# Altium schematic sheet Lights.SchDoc: RGB LEDS
size Letter; Author: Parth Thakkar; CompanyName: Insane Corp; DrawnBy: Parth Thakkar; Engineer: Parth Thakkar; Organization: Low Self Esteem; Revision: v1.0; SheetNumber: 8; SheetTotal: 8
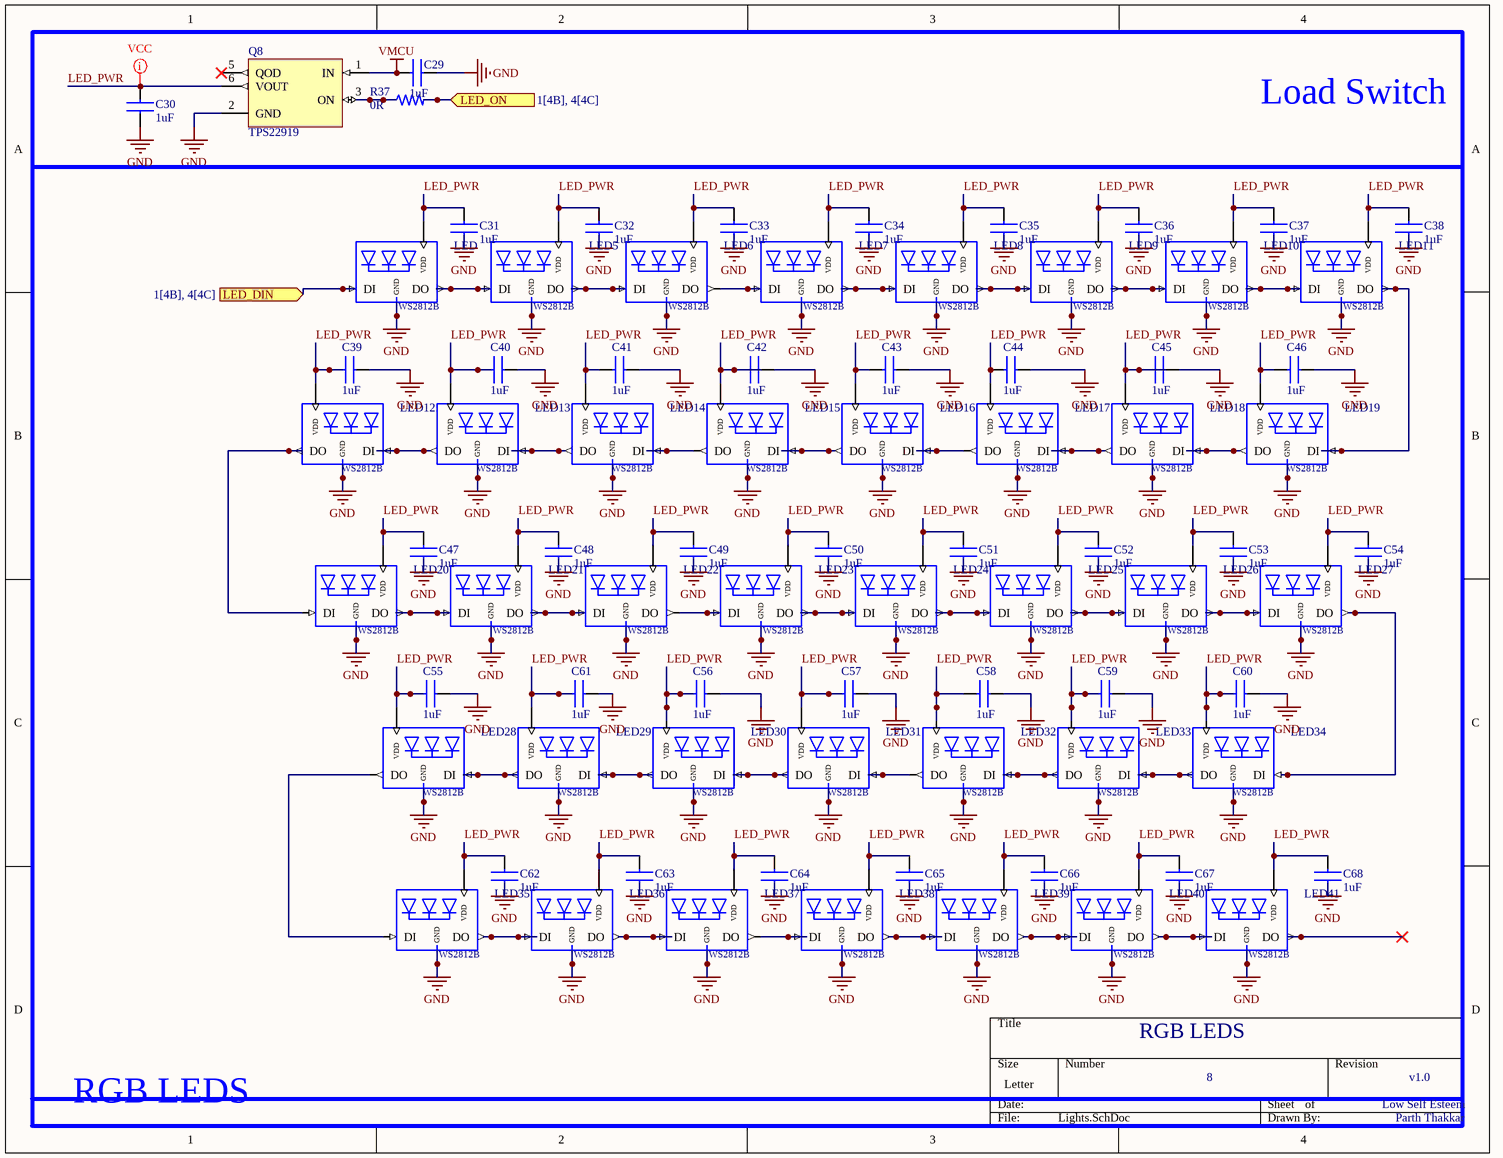
[diagram p0: Lights.SchDoc]

## Parts
C29  value 1uF  [Capacitor 0603]  (hidden comment: CAP 1uF 10V 0603)
C30  value 1uF  [CAPACITOR 0805]  (hidden comment: CAP 47uF 10V 0805)
C31  value 1uF  [Capacitor 0603]  (hidden comment: CAP 1uF 10V 0603)
C32  value 1uF  [Capacitor 0603]  (hidden comment: CAP 1uF 10V 0603)
C33  value 1uF  [Capacitor 0603]  (hidden comment: CAP 1uF 10V 0603)
C34  value 1uF  [Capacitor 0603]  (hidden comment: CAP 1uF 10V 0603)
C35  value 1uF  [Capacitor 0603]  (hidden comment: CAP 1uF 10V 0603)
C36  value 1uF  [Capacitor 0603]  (hidden comment: CAP 1uF 10V 0603)
C37  value 1uF  [Capacitor 0603]  (hidden comment: CAP 1uF 10V 0603)
C38  value 1uF  [Capacitor 0603]  (hidden comment: CAP 1uF 10V 0603)
C39  value 1uF  [Capacitor 0603]  (hidden comment: CAP 1uF 10V 0603)
C40  value 1uF  [Capacitor 0603]  (hidden comment: CAP 1uF 10V 0603)
C41  value 1uF  [Capacitor 0603]  (hidden comment: CAP 1uF 10V 0603)
C42  value 1uF  [Capacitor 0603]  (hidden comment: CAP 1uF 10V 0603)
C43  value 1uF  [Capacitor 0603]  (hidden comment: CAP 1uF 10V 0603)
C44  value 1uF  [Capacitor 0603]  (hidden comment: CAP 1uF 10V 0603)
C45  value 1uF  [Capacitor 0603]  (hidden comment: CAP 1uF 10V 0603)
C46  value 1uF  [Capacitor 0603]  (hidden comment: CAP 1uF 10V 0603)
C47  value 1uF  [Capacitor 0603]  (hidden comment: CAP 1uF 10V 0603)
C48  value 1uF  [Capacitor 0603]  (hidden comment: CAP 1uF 10V 0603)
C49  value 1uF  [Capacitor 0603]  (hidden comment: CAP 1uF 10V 0603)
C50  value 1uF  [Capacitor 0603]  (hidden comment: CAP 1uF 10V 0603)
C51  value 1uF  [Capacitor 0603]  (hidden comment: CAP 1uF 10V 0603)
C52  value 1uF  [Capacitor 0603]  (hidden comment: CAP 1uF 10V 0603)
C53  value 1uF  [Capacitor 0603]  (hidden comment: CAP 1uF 10V 0603)
C54  value 1uF  [Capacitor 0603]  (hidden comment: CAP 1uF 10V 0603)
C55  value 1uF  [Capacitor 0603]  (hidden comment: CAP 1uF 10V 0603)
C56  value 1uF  [Capacitor 0603]  (hidden comment: CAP 1uF 10V 0603)
C57  value 1uF  [Capacitor 0603]  (hidden comment: CAP 1uF 10V 0603)
C58  value 1uF  [Capacitor 0603]  (hidden comment: CAP 1uF 10V 0603)
C59  value 1uF  [Capacitor 0603]  (hidden comment: CAP 1uF 10V 0603)
C60  value 1uF  [Capacitor 0603]  (hidden comment: CAP 1uF 10V 0603)
C61  value 1uF  [Capacitor 0603]  (hidden comment: CAP 1uF 10V 0603)
C62  value 1uF  [Capacitor 0603]  (hidden comment: CAP 1uF 10V 0603)
C63  value 1uF  [Capacitor 0603]  (hidden comment: CAP 1uF 10V 0603)
C64  value 1uF  [Capacitor 0603]  (hidden comment: CAP 1uF 10V 0603)
C65  value 1uF  [Capacitor 0603]  (hidden comment: CAP 1uF 10V 0603)
C66  value 1uF  [Capacitor 0603]  (hidden comment: CAP 1uF 10V 0603)
C67  value 1uF  [Capacitor 0603]  (hidden comment: CAP 1uF 10V 0603)
C68  value 1uF  [Capacitor 0603]  (hidden comment: CAP 1uF 10V 0603)
LED  WS2812B  [WS2812B]  (value not drawn)
LED5  WS2812B  [WS2812B]  (value not drawn)
LED6  WS2812B  [WS2812B]  (value not drawn)
LED7  WS2812B  [WS2812B]  (value not drawn)
LED8  WS2812B  [WS2812B]  (value not drawn)
LED9  WS2812B  [WS2812B]  (value not drawn)
LED10  WS2812B  [WS2812B]  (value not drawn)
LED11  WS2812B  [WS2812B]  (value not drawn)
LED12  WS2812B  [WS2812B]  (value not drawn)
LED13  WS2812B  [WS2812B]  (value not drawn)
LED14  WS2812B  [WS2812B]  (value not drawn)
LED15  WS2812B  [WS2812B]  (value not drawn)
LED16  WS2812B  [WS2812B]  (value not drawn)
LED17  WS2812B  [WS2812B]  (value not drawn)
LED18  WS2812B  [WS2812B]  (value not drawn)
LED19  WS2812B  [WS2812B]  (value not drawn)
LED20  WS2812B  [WS2812B]  (value not drawn)
LED21  WS2812B  [WS2812B]  (value not drawn)
LED22  WS2812B  [WS2812B]  (value not drawn)
LED23  WS2812B  [WS2812B]  (value not drawn)
LED24  WS2812B  [WS2812B]  (value not drawn)
LED25  WS2812B  [WS2812B]  (value not drawn)
LED26  WS2812B  [WS2812B]  (value not drawn)
LED27  WS2812B  [WS2812B]  (value not drawn)
LED28  WS2812B  [WS2812B]  (value not drawn)
LED29  WS2812B  [WS2812B]  (value not drawn)
LED30  WS2812B  [WS2812B]  (value not drawn)
LED31  WS2812B  [WS2812B]  (value not drawn)
LED32  WS2812B  [WS2812B]  (value not drawn)
LED33  WS2812B  [WS2812B]  (value not drawn)
LED34  WS2812B  [WS2812B]  (value not drawn)
LED35  WS2812B  [WS2812B]  (value not drawn)
LED36  WS2812B  [WS2812B]  (value not drawn)
LED37  WS2812B  [WS2812B]  (value not drawn)
LED38  WS2812B  [WS2812B]  (value not drawn)
LED39  WS2812B  [WS2812B]  (value not drawn)
LED40  WS2812B  [WS2812B]  (value not drawn)
LED41  WS2812B  [WS2812B]  (value not drawn)
Q8  TPS22919  [TPS22919DCKR - Load SW]
R37  value 0R  [Resistor 0402]  (hidden comment: RES 0R 0402)

## Ports
LED_DIN (in, see 1[4B], 4[4C]), LED_ON (in, see 1[4B], 4[4C])

## Nets
GND: C29.2 C30.2 C31.2 C32.2 C33.2 C34.2 C35.2 C36.2 C37.2 C38.2 C39.2 C40.2 C41.2 C42.2 C43.2 C44.2 C45.2 C46.2 C47.2 C48.2 C49.2 C50.2 C51.2 C52.2 C53.2 C54.2 C55.2 C56.2 C57.2 C58.2 C59.2 C60.2 C61.2 C62.2 C63.2 C64.2 C65.2 C66.2 C67.2 C68.2 LED.3-GND(GND) LED5.3-GND(GND) LED6.3-GND(GND) LED7.3-GND(GND) LED8.3-GND(GND) LED9.3-GND(GND) LED10.3-GND(GND) LED11.3-GND(GND) LED12.3-GND(GND) LED13.3-GND(GND) LED14.3-GND(GND) LED15.3-GND(GND) LED16.3-GND(GND) LED17.3-GND(GND) LED18.3-GND(GND) LED19.3-GND(GND) LED20.3-GND(GND) LED21.3-GND(GND) LED22.3-GND(GND) LED23.3-GND(GND) LED24.3-GND(GND) LED25.3-GND(GND) LED26.3-GND(GND) LED27.3-GND(GND) LED28.3-GND(GND) LED29.3-GND(GND) LED30.3-GND(GND) LED31.3-GND(GND) LED32.3-GND(GND) LED33.3-GND(GND) LED34.3-GND(GND) LED35.3-GND(GND) LED36.3-GND(GND) LED37.3-GND(GND) LED38.3-GND(GND) LED39.3-GND(GND) LED40.3-GND(GND) LED41.3-GND(GND) Q8.2(GND)
VMCU: C29.1 Q8.1(IN)
LED_DIN: LED.4-DIN(DI) ; port LED_DIN
LED_ON: R37.2 ; port LED_ON
LED_PWR: C30.1 C31.1 C32.1 C33.1 C34.1 C35.1 C36.1 C37.1 C38.1 C39.1 C40.1 C41.1 C42.1 C43.1 C44.1 C45.1 C46.1 C47.1 C48.1 C49.1 C50.1 C51.1 C52.1 C53.1 C54.1 C55.1 C56.1 C57.1 C58.1 C59.1 C60.1 C61.1 C62.1 C63.1 C64.1 C65.1 C66.1 C67.1 C68.1 LED.1-VDD(VDD) LED5.1-VDD(VDD) LED6.1-VDD(VDD) LED7.1-VDD(VDD) LED8.1-VDD(VDD) LED9.1-VDD(VDD) LED10.1-VDD(VDD) LED11.1-VDD(VDD) LED12.1-VDD(VDD) LED13.1-VDD(VDD) LED14.1-VDD(VDD) LED15.1-VDD(VDD) LED16.1-VDD(VDD) LED17.1-VDD(VDD) LED18.1-VDD(VDD) LED19.1-VDD(VDD) LED20.1-VDD(VDD) LED21.1-VDD(VDD) LED22.1-VDD(VDD) LED23.1-VDD(VDD) LED24.1-VDD(VDD) LED25.1-VDD(VDD) LED26.1-VDD(VDD) LED27.1-VDD(VDD) LED28.1-VDD(VDD) LED29.1-VDD(VDD) LED30.1-VDD(VDD) LED31.1-VDD(VDD) LED32.1-VDD(VDD) LED33.1-VDD(VDD) LED34.1-VDD(VDD) LED35.1-VDD(VDD) LED36.1-VDD(VDD) LED37.1-VDD(VDD) LED38.1-VDD(VDD) LED39.1-VDD(VDD) LED40.1-VDD(VDD) LED41.1-VDD(VDD) Q8.6(VOUT)
NetLED5_2-DOUT: LED5.2-DOUT(DO) LED6.4-DIN(DI)
NetLED6_2-DOUT: LED6.2-DOUT(DO) LED7.4-DIN(DI)
NetLED7_2-DOUT: LED7.2-DOUT(DO) LED8.4-DIN(DI)
NetLED8_2-DOUT: LED8.2-DOUT(DO) LED9.4-DIN(DI)
NetLED9_2-DOUT: LED9.2-DOUT(DO) LED10.4-DIN(DI)
NetLED10_2-DOUT: LED10.2-DOUT(DO) LED11.4-DIN(DI)
NetLED11_2-DOUT: LED11.2-DOUT(DO) LED19.4-DIN(DI)
NetLED12_2-DOUT: LED12.2-DOUT(DO) LED20.4-DIN(DI)
NetLED12_4-DIN: LED12.4-DIN(DI) LED13.2-DOUT(DO)
NetLED13_4-DIN: LED13.4-DIN(DI) LED14.2-DOUT(DO)
NetLED14_4-DIN: LED14.4-DIN(DI) LED15.2-DOUT(DO)
NetLED15_4-DIN: LED15.4-DIN(DI) LED16.2-DOUT(DO)
NetLED16_4-DIN: LED16.4-DIN(DI) LED17.2-DOUT(DO)
NetLED17_4-DIN: LED17.4-DIN(DI) LED18.2-DOUT(DO)
NetLED18_4-DIN: LED18.4-DIN(DI) LED19.2-DOUT(DO)
NetLED20_2-DOUT: LED20.2-DOUT(DO) LED21.4-DIN(DI)
NetLED21_2-DOUT: LED21.2-DOUT(DO) LED22.4-DIN(DI)
NetLED22_2-DOUT: LED22.2-DOUT(DO) LED23.4-DIN(DI)
NetLED23_2-DOUT: LED23.2-DOUT(DO) LED24.4-DIN(DI)
NetLED24_2-DOUT: LED24.2-DOUT(DO) LED25.4-DIN(DI)
NetLED25_2-DOUT: LED25.2-DOUT(DO) LED26.4-DIN(DI)
NetLED26_2-DOUT: LED26.2-DOUT(DO) LED27.4-DIN(DI)
NetLED27_2-DOUT: LED27.2-DOUT(DO) LED34.4-DIN(DI)
NetLED28_2-DOUT: LED28.2-DOUT(DO) LED35.4-DIN(DI)
NetLED28_4-DIN: LED28.4-DIN(DI) LED29.2-DOUT(DO)
NetLED29_4-DIN: LED29.4-DIN(DI) LED30.2-DOUT(DO)
NetLED30_4-DIN: LED30.4-DIN(DI) LED31.2-DOUT(DO)
NetLED31_4-DIN: LED31.4-DIN(DI) LED32.2-DOUT(DO)
NetLED32_4-DIN: LED32.4-DIN(DI) LED33.2-DOUT(DO)
NetLED33_4-DIN: LED33.4-DIN(DI) LED34.2-DOUT(DO)
NetLED35_2-DOUT: LED35.2-DOUT(DO) LED36.4-DIN(DI)
NetLED36_2-DOUT: LED36.2-DOUT(DO) LED37.4-DIN(DI)
NetLED37_2-DOUT: LED37.2-DOUT(DO) LED38.4-DIN(DI)
NetLED38_2-DOUT: LED38.2-DOUT(DO) LED39.4-DIN(DI)
NetLED39_2-DOUT: LED39.2-DOUT(DO) LED40.4-DIN(DI)
NetLED40_2-DOUT: LED40.2-DOUT(DO) LED41.4-DIN(DI)
NetLED_2-DOUT: LED.2-DOUT(DO) LED5.4-DIN(DI)
NetQ8_3: Q8.3(ON) R37.1

Not connected (* = marked no-connect by the designer): LED41 2-DOUT(DO)*; Q8 5(QOD)*

## Layout directives
rule Width Constraint [Pref Width = 20mil    Min Width = 6mil    Max Width = 20mil]: LED_PWR

## Notes on the sheet
- Load Switch
- RGB LEDS

## Library data of the parts
C29 C31-C68 = CAP 1uF 10V 0603: Ceramic Capacitor, Multilayer, Ceramic, 10V, 10% +Tol, 10% -Tol, X5R, 15% TC, 1uF, Surface Mount, 0603; Manufacturer: Murata; Manufacturer Part Number: GRM188R61A105KA61D; Multilayer: Yes; Supplier: Digikey; Supplier Part Number: 490-1543-1-ND; RoHS: Yes; Category: Ceramic Capacitors; Stock: 2506225; Pricing: 1=0.1, 10=0.059, 50=0.0408, 100=0.0354, 500=0.0261, 1000=0.02321 (USD); Mounting Technology: Surface Mount; Pins: 2; Dielectric Material: Ceramic; Package Shape: Rectangular; Case/Package: 0603; Terminal Finish: Nickel; Min Operating Temperature: -55°C; Max Operating Temperature: 85°C; JESD-609 Code: e3; Capacitor Type: Ceramic; Tolerance  (fill in as +-): 10%; Package Style: SMTMeter; Packaging: Tape and Reel; Tolerance (fill in as +-): 10%; Rated DC Voltage (URdc): 10V; Temperature Characteristics Code: X5R; Termination: Wraparound; Length: 1.6mm; Width: 0.8mm; Height: 0.8mm; Reach SVHC Compliant: Yes; RoHS Compliant: Yes; ComponentLink1URL: https://psearch.en.murata.com:443/capacitor/product/GRM188R61A105KA61%23.pdf?src-supplier=IHS+Markit; ComponentLink1Description: https://psearch.en.murata.com:443/capacitor/product/GRM188R61A105KA61%23.pdf?src-supplier=IHS+Markit; ComponentLink2URL: https://datasheet.ciiva.com/18102/getdatasheetpartid-85467-18102910.pdf?src-supplier=Verical; ComponentLink2Description: https://datasheet.ciiva.com/18102/getdatasheetpartid-85467-18102910.pdf?src-supplier=Verical; ComponentLink3URL: https://datasheet.ciiva.com/19476/1857381-19476568.pdf?src-supplier=Jameco; ComponentLink3Description: https://datasheet.ciiva.com/19476/1857381-19476568.pdf?src-supplier=Jameco; ComponentLink4URL: https://datasheet.ciiva.com/7719/608985-7719036.pdf?src-supplier=Element14; ComponentLink4Description: https://datasheet.ciiva.com/7719/608985-7719036.pdf?src-supplier=Element14; ComponentLink5URL: https://datasheet.ciiva.com/22706/608985-22706782.pdf?src-supplier=Element14; ComponentLink5Description: https://datasheet.ciiva.com/22706/608985-22706782.pdf?src-supplier=Element14; ComponentLink6URL: https://datasheet.ciiva.com/131/partnumbering-e-01-131741.pdf?src-supplier=Digikey; ComponentLink6Description: https://datasheet.ciiva.com/131/partnumbering-e-01-131741.pdf?src-supplier=Digikey; ComponentLink7URL: https://datasheet.ciiva.com/131/partnumbering-e-01-131742.pdf?src-supplier=Digikey; ComponentLink7Description: https://datasheet.ciiva.com/131/partnumbering-e-01-131742.pdf?src-supplier=Digikey; ComponentLink8URL: https://datasheet.ciiva.com/131/partnumbering-e-01-131743.pdf?src-supplier=Digikey; ComponentLink8Description: https://datasheet.ciiva.com/131/partnumbering-e-01-131743.pdf?src-supplier=Digikey; ComponentLink9URL: https://datasheet.ciiva.com/16199/product-16199724.pdf?src-supplier=Future+Electronics; ComponentLink9Description: https://datasheet.ciiva.com/16199/product-16199724.pdf?src-supplier=Future+Electronics
C30 = CAP 47uF 10V 0805: Multilayer Ceramic Capacitor, 1 uF, 10 V, ± 20%, X5R, 0201 [0603 Metric]; Manufacturer: Murata; Manufacturer Part Number: GRM033R61A105ME15D; Supplier: Digikey; Supplier Part Number: 490-13226-1-ND; RoHS: Yes; Category: Ceramic Capacitors; Stock: 595344; Pricing: 1=0.35, 10=0.204, 50=0.147, 100=0.1291, 500=0.0988, 1000=0.08934, 2500=0.0793, 5000=0.07321 (USD); Mounting Technology: Surface Mount; Case/Package: 0201; Case Code (Imperial): 0201; Case Code (Metric): 0603; Material: Ceramic; Min Operating Temperature: -55°C; Max Operating Temperature: 85°C; Packaging: Cut Tape; Voltage Rating: 10V; Tolerance: 20%; Dielectric: X5R; Voltage Rating (DC): 10V; Series: GRM; Height: 390um; RoHS Compliant: Yes; ComponentLink1URL: http://search.murata.co.jp/Ceramy/image/img/A01X/G101/ENG/GRM033R61A105ME15-01.pdf?src-supplier=Digikey; ComponentLink1Description: http://search.murata.co.jp/Ceramy/image/img/A01X/G101/ENG/GRM033R61A105ME15-01.pdf?src-supplier=Digikey; ComponentLink2URL: https://datasheet.octopart.com/GRM033R61A105ME15D-Murata-datasheet-86568077.pdf?src-supplier=Future+Electronics; ComponentLink2Description: https://datasheet.octopart.com/GRM033R61A105ME15D-Murata-datasheet-86568077.pdf?src-supplier=Future+Electronics; Length: 0.024inch; Width: 0.012inch; Thickness: 0.015inch
LED LED5-LED41 = WS2812B: Raspberry Pi HAT _40 pin_ Wheeled Robotics Kit; MF: SparkFun Electronics; Availability: Unavailable; SnapEDA_Link: https://www.snapeda.com/parts/WS2812B/Worldsemi/view-part/1038297/?ref=snap; MP: WS2812B; Price: None; Value: *; Package: None
Q8 = TPS22919: Buffer/Inverter Based Peripheral Driver, 3A, PDSO6; Manufacturer: Texas Instruments; Manufacturer Part Number: TPS22919DCKT; Supplier: Mouser; Supplier Part Number: 595-TPS22919DCKT; RoHS: Yes; Category: Power Management ICs; Stock: 6490; Pricing: 1=0.94, 10=0.712, 50=0.712, 100=0.413, 1000=0.308, 10000=0.308 (USD); ComponentLink1URL: https://www.ti.com:443/lit/ds/symlink/tps22919.pdf?src-supplier=IHS+Markit; ComponentLink1Description: https://www.ti.com:443/lit/ds/symlink/tps22919.pdf?src-supplier=IHS+Markit; ComponentLink2URL: http://www.ti.com/general/docs/suppproductinfo.tsp?distId=10&amp;gotoUrl=http%3A%2F%2Fwww.ti.com%2Flit%2Fgpn%2Ftps22919&src-supplier=Digikey; ComponentLink2Description: http://www.ti.com/general/docs/suppproductinfo.tsp?distId=10&amp;gotoUrl=http%3A%2F%2Fwww.ti.com%2Flit%2Fgpn%2Ftps22919&src-supplier=Digikey
R37 = RES 0R 0402: Metal Glaze/thick Film, 0.0625W, 0ohm, Surface Mount, 0402; Manufacturer: Yageo; Manufacturer Part Number: RC0402JR-070RL; Power: 62.5mW; Rated Temperature: 70°C; Package Height: 0.35mm; Package Length: 1mm; Package Width: 0.5mm; Supplier: Digikey; Supplier Part Number: 311-0.0JRCT-ND; RoHS: Yes; Category: Chip SMD Resistors; Stock: 15179907; Pricing: 1=0.1, 10=0.011, 25=0.0084, 50=0.0064, 100=0.0045, 250=0.00364, 500=0.0029, 1000=0.00214, 5000=0.00154, 10000=0.00133, 30000=0.00117, 50000=0.00107, 100000=0.00105 (USD); Mounting Technology: Surface Mount; Pins: 2; Package Shape: Rectangular; Case/Package: 0402; Terminal Finish: Nickel; Min Operating Temperature: -55°C; Max Operating Temperature: 155°C; JESD-609 Code: e3; Resistor Type: FIXED RESISTOR; Construction: Chip; Package Style: SMTMeter; Packaging: Tape and Reel; Technology: METAL GLAZE/THICK FILM; Termination: Wraparound; Reach SVHC Compliant: Yes; RoHS Compliant: Yes; ComponentLink1URL: https://datasheet.ciiva.com:443/pdfs/VipMasterIC/IC/YAGO/YAGO-S-A0008145938/YAGO-S-A0008145938-1.pdf?src-supplier=IHS+Markit; ComponentLink1Description: https://datasheet.ciiva.com:443/pdfs/VipMasterIC/IC/YAGO/YAGO-S-A0008145938/YAGO-S-A0008145938-1.pdf?src-supplier=IHS+Markit; ComponentLink2URL: https://datasheet.ciiva.com/2452/pyu-rc0402-51-rohs-l-6-2452608.pdf?src-supplier=Digikey; ComponentLink2Description: https://datasheet.ciiva.com/2452/pyu-rc0402-51-rohs-l-6-2452608.pdf?src-supplier=Digikey; ComponentLink3URL: https://datasheet.ciiva.com/11808/0900766b80c66297-11808195.pdf?src-supplier=Rs; ComponentLink3Description: https://datasheet.ciiva.com/11808/0900766b80c66297-11808195.pdf?src-supplier=Rs; ComponentLink4URL: https://datasheet.ciiva.com/2452/pyu-r-int-thick-7-2452609.pdf?src-supplier=Digikey; ComponentLink4Description: https://datasheet.ciiva.com/2452/pyu-r-int-thick-7-2452609.pdf?src-supplier=Digikey; ComponentLink5URL: https://datasheet.ciiva.com/2452/pyu-r-int-thick-7-2452610.pdf?src-supplier=Digikey; ComponentLink5Description: https://datasheet.ciiva.com/2452/pyu-r-int-thick-7-2452610.pdf?src-supplier=Digikey; ComponentLink6URL: https://datasheet.ciiva.com/8896/pyu-rc0402-51-rohs-l-6-8896201.pdf?src-supplier=Avnet; ComponentLink6Description: https://datasheet.ciiva.com/8896/pyu-rc0402-51-rohs-l-6-8896201.pdf?src-supplier=Avnet; ComponentLink7URL: https://datasheet.ciiva.com/7983/1018594-7983535.pdf?src-supplier=Element14; ComponentLink7Description: https://datasheet.ciiva.com/7983/1018594-7983535.pdf?src-supplier=Element14; ComponentLink8URL: https://datasheet.ciiva.com/22747/1018594-22747515.pdf?src-supplier=Element14; ComponentLink8Description: https://datasheet.ciiva.com/22747/1018594-22747515.pdf?src-supplier=Element14